# EAGLE schematic EXT_DC_OUT (EAGLE 6.4)
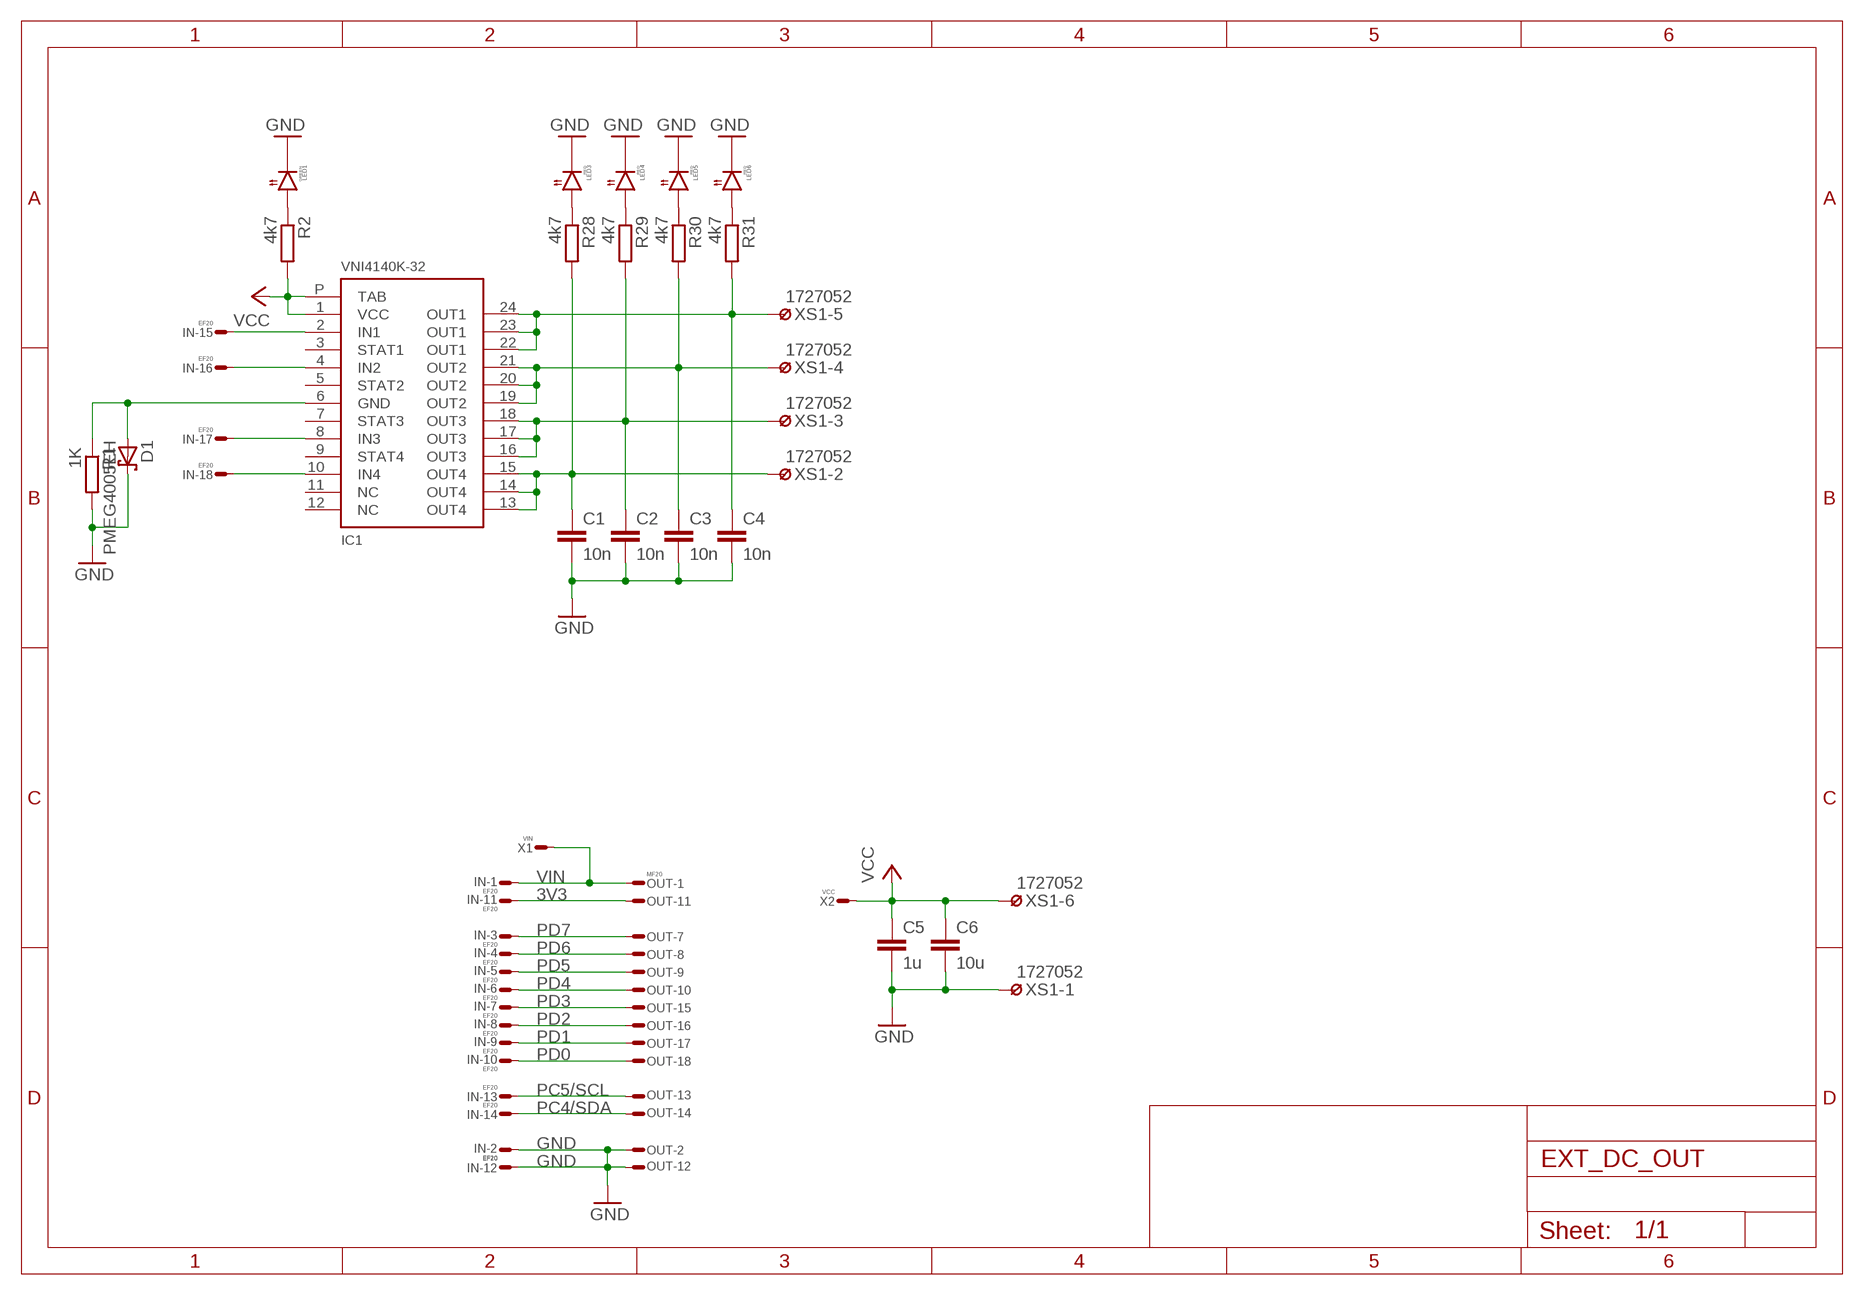
[diagram p0: schematic, sheet 1]

## Parts
C1  10n  C1206  [1206]
C2  10n  C1206  [1206]
C3  10n  C1206  [1206]
C4  10n  C1206  [1206]
C5  1u  C1206  [1206]
C6  10u  CC1210  [C1210]
D1  PMEG4005EH  D-SCHOTKY123  [SOD123]
IC1  VNI4140K-32  VNI4140  [PSSO-24]
IN  EF20  FE20ELS  [FE10-2WS]
LED1  GREEN  LED1206  [1206]
LED3  RED  LED1206  [1206]
LED4  RED  LED1206  [1206]
LED5  RED  LED1206  [1206]
LED6  RED  LED1206  [1206]
OUT  MF20  ML20LSE  [ML20LS]
R1  1K  R1206  [1206]
R2  4k7  R1206  [1206]
R28  4k7  R1206  [1206]
R29  4k7  R1206  [1206]
R30  4k7  R1206  [1206]
R31  4k7  R1206  [1206]
X1  VIN  WIREPADT1.6/0.9  [T1.6/0.9]
X2  VCC  WIREPADT1.6/0.9  [T1.6/0.9]
XS1  1727052  [1727052]

## Nets
3V3: IN.P$11 OUT.P$11
GND: C1.2 C2.2 C3.2 C4.2 C5.2 C6.2 D1.C IN.P$2 IN.P$12 LED1.2(C) LED3.2(C) LED4.2(C) LED5.2(C) LED6.2(C) OUT.P$2 OUT.P$12 R1.2 XS1.1
N$1: IC1.2(IN1) IN.P$15
N$2: IC1.4(IN2) IN.P$16
N$3: IC1.8(IN3) IN.P$17
N$4: IC1.10(IN4) IN.P$18
N$5: C4.1 IC1.22(OUT1) IC1.23(OUT1) IC1.24(OUT1) R31.2 XS1.5
N$6: C3.1 IC1.19(OUT2) IC1.20(OUT2) IC1.21(OUT2) R30.2 XS1.4
N$7: C2.1 IC1.16(OUT3) IC1.17(OUT3) IC1.18(OUT3) R29.2 XS1.3
N$8: C1.1 IC1.13(OUT4) IC1.14(OUT4) IC1.15(OUT4) R28.2 XS1.2
N$9: D1.A IC1.6(GND) R1.1
N$10: LED1.1(A) R2.1
N$12: LED3.1(A) R28.1
N$14: LED4.1(A) R29.1
N$16: LED5.1(A) R30.1
N$18: LED6.1(A) R31.1
PC4/SDA: IN.P$14 OUT.P$14
PC5/SCL: IN.P$13 OUT.P$13
PD0: IN.P$10 OUT.P$18
PD1: IN.P$9 OUT.P$17
PD2: IN.P$8 OUT.P$16
PD3: IN.P$7 OUT.P$15
PD4: IN.P$6 OUT.P$10
PD5: IN.P$5 OUT.P$9
PD6: IN.P$4 OUT.P$8
PD7: IN.P$3 OUT.P$7
VCC: C5.1 C6.1 IC1.1(VCC) IC1.P(TAB) R2.2 X2.1(S) XS1.6
VIN: IN.P$1 OUT.P$1 X1.1(S)
Unconnected: IC1.3(STAT1) IC1.5(STAT2) IC1.7(STAT3) IC1.9(STAT4) IC1.11(NC) IC1.12(NC) IN.P$19 IN.P$20 OUT.P$3 OUT.P$4 OUT.P$5 OUT.P$6 OUT.P$19 OUT.P$20

## Library data of the parts
C1-C6 = RCL:C: Capacitor SMD
D1 = Diode:D-SCHOTKY: Schottky Diode
IC1 = ICs:VNI4140: Quad high-side smart power solid state relay 41V/1.0A/0.08R
IN = Conn:FE20E
LED1 LED3-LED6 = Optic:LED
OUT = Conn:ML20?E: HARTING
R1 R2 R28-R31 = RCL:R: Resistor SMD
X1 X2 = Conn:WIREPAD: Wire PAD connect wire on PCB
XS1 = Conn:1727052